# Altium schematic sheet MCU.SchDoc: Gimbal - Microcontroller
size Letter; DrawnBy: Jing Hao Yao; Organization: UW Robotics; Address1: 200 University Avenue; Address2: Waterloo; Address3: Ontario; Address4: Canada N2L 3G6; SheetNumber: 1; SheetTotal: 5
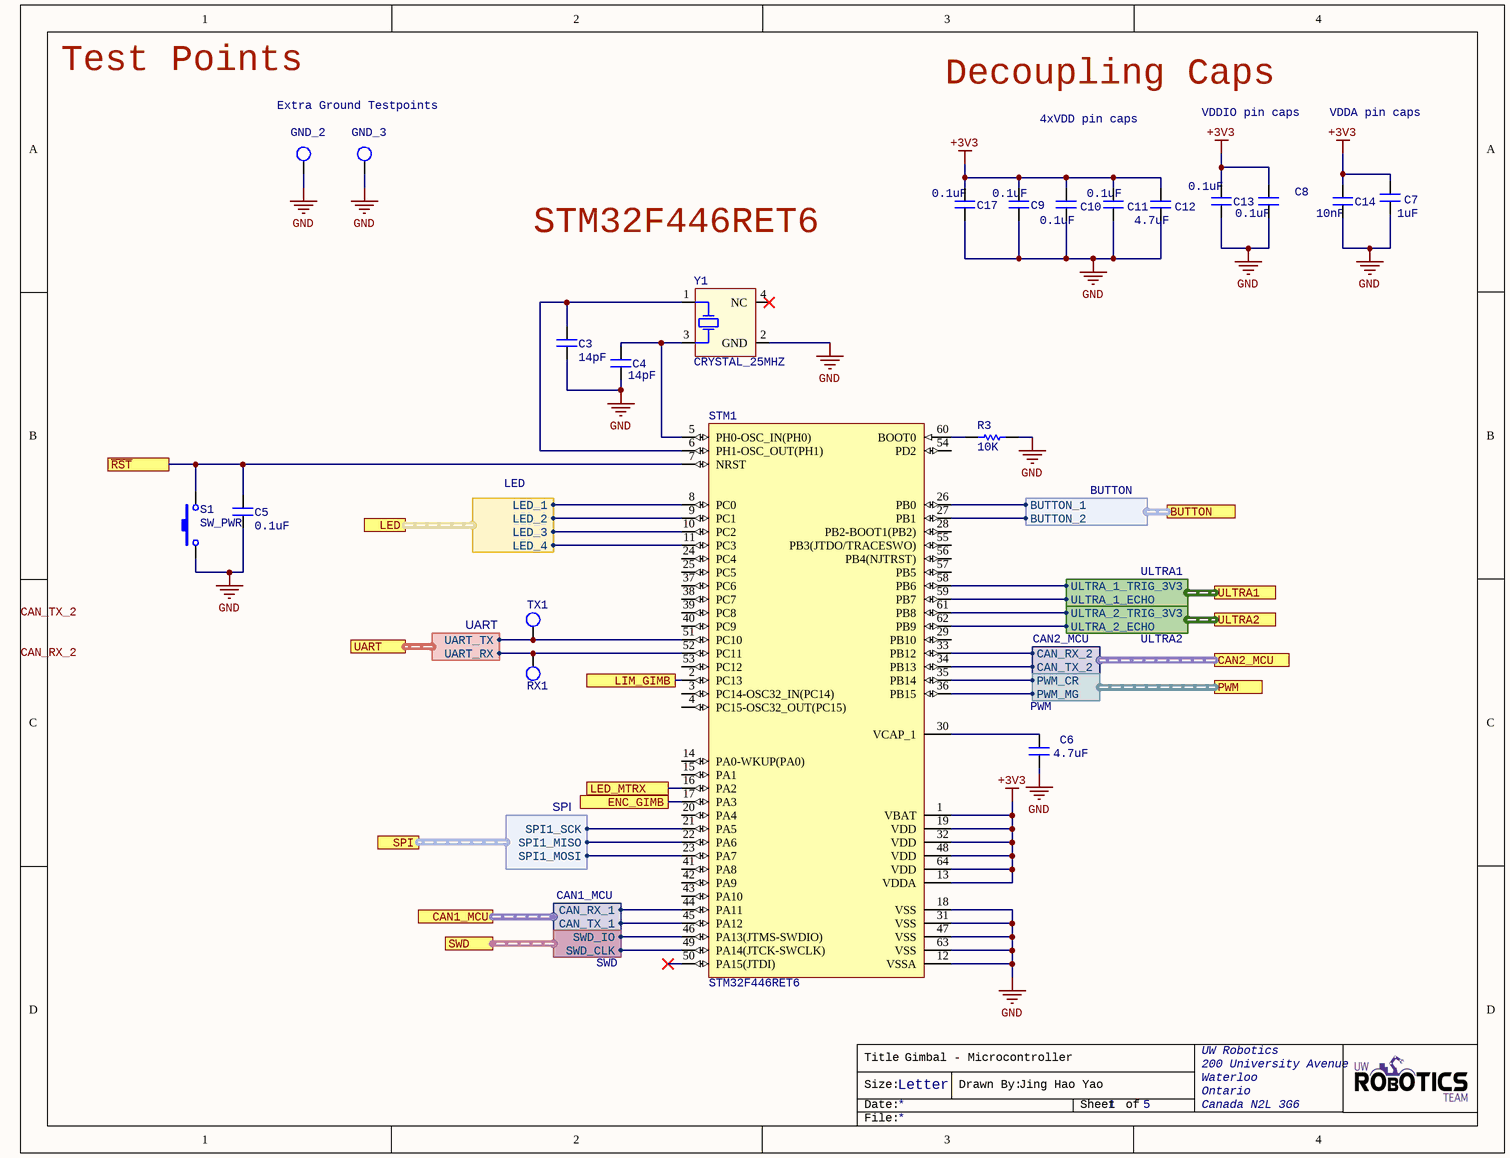
[diagram p0: MCU.SchDoc]

## Parts
C3  value 14pF  [CAPC0603(1608)55_N]  (hidden comment: CL10C140JB8NNNC)
C4  value 14pF  [CAPC0603(1608)55_N]  (hidden comment: CL10C140JB8NNNC)
C5  value 0.1uF  [CAPC0603(1608)55_N]  (hidden comment: CAP_0.1uF_16V_0603)
C6  value 4.7uF  [CAPC0603(1608)55_N]  (hidden comment: CAP_4.7uF_0603)
C7  value 1uF  [CAPC0603(1608)55_N]  (hidden comment: CAP_1uF_16V_0603)
C8  value 0.1uF  [CAPC0603(1608)55_N]  (hidden comment: CAP_0.1uF_16V_0603)
C9  value 0.1uF  [CAPC0603(1608)55_N]  (hidden comment: CAP_0.1uF_16V_0603)
C10  value 0.1uF  [CAPC0603(1608)55_N]  (hidden comment: CAP_0.1uF_16V_0603)
C11  value 0.1uF  [CAPC0603(1608)55_N]  (hidden comment: CAP_0.1uF_16V_0603)
C12  value 4.7uF  [CAPC0603(1608)55_N]  (hidden comment: CAP_4.7uF_0603)
C13  value 0.1uF  [CAPC0603(1608)55_N]  (hidden comment: CAP_0.1uF_16V_0603)
C14  value 10nF  [CAPC0603(1608)55_N]  (hidden comment: CAP_10nF_0603)
C17  value 0.1uF  [CAPC0603(1608)55_N]  (hidden comment: CAP_0.1uF_16V_0603)
GND_2  TESTPOINT_LOOP  [TESTPOINT_LOOP]  (value not drawn)
GND_3  TESTPOINT_LOOP  [TESTPOINT_LOOP]  (value not drawn)
R3  value 10K  [RESC0603(1608)_N]  (hidden comment: RES_10K_0603)
RX1  TESTPOINT_LOOP  [TESTPOINT_LOOP]  (value not drawn)
S1  SW_PWR  [PTS830GM140]
STM1  STM32F446RET6  [STM-LQFP64_L]
TX1  TESTPOINT_LOOP  [TESTPOINT_LOOP]  (value not drawn)
Y1  CRYSTAL_25MHZ  [AVX-CX2520DB32000D0GEJZ1-4_V]

## Ports
BUTTON (harness BUTTON), CAN1_MCU (harness CAN1_MCU), CAN2_MCU (harness CAN2_MCU), ENC_GIMB, LED (harness LED), LED_MTRX, LIM_GIMB, PWM (harness PWM), SPI (harness SPI), SWD (harness SWD), UART (harness UART), ULTRA1 (harness ULTRA1), ULTRA2 (harness ULTRA2), ~{RST}

## Harnesses
UART: UART_RX, UART_TX
ULTRA1: ULTRA_1_TRIG_3V3, ULTRA_1_ECHO
ULTRA2: ULTRA_2_TRIG_3V3, ULTRA_2_ECHO
CAN1_MCU: CAN_RX_1, CAN_TX_1
CAN2_MCU: CAN_RX_2, CAN_TX_2
LED: LED_1, LED_2, LED_3, LED_4
SPI: SPI1_SCK, SPI1_MISO, SPI1_MOSI
SWD: SWD_IO, SWD_CLK
BUTTON: BUTTON_1, BUTTON_2
PWM: PWM_CR, PWM_MG

## Nets
+3V3: C7.2 C8.2 C9.2 C10.2 C11.2 C12.2 C13.2 C14.2 C17.2 STM1.1(VBAT) STM1.13(VDDA) STM1.19(VDD) STM1.32(VDD) STM1.48(VDD) STM1.64(VDD)
GND: C3.1 C4.1 C5.1 C6.1 C7.1 C8.1 C9.1 C10.1 C11.1 C12.1 C13.1 C14.1 C17.1 GND_2.1 GND_3.1 R3.2 S1.1 STM1.12(VSSA) STM1.18(VSS) STM1.31(VSS) STM1.47(VSS) STM1.63(VSS) Y1.2(GND)
~{RST}: C5.2 S1.2 STM1.7(NRST) ; port ~{RST}
ENC_GIMB: STM1.17(PA3) ; port ENC_GIMB
LED_MTRX: STM1.16(PA2) ; port LED_MTRX
LIM_GIMB: STM1.2(PC13) ; port LIM_GIMB
NetC3_2: C3.2 STM1.6(PH1-OSC_OUT(PH1)) Y1.1(HOT)
NetC4_2: C4.2 STM1.5(PH0-OSC_IN(PH0)) Y1.3(HOT)
NetC6_2: C6.2 STM1.30(VCAP_1)
NetR3_1: R3.1 STM1.60(BOOT0)
NetRX1_1: RX1.1 STM1.52(PC11) ; port UART.UART_RX
NetSTM1_8: STM1.8(PC0) ; port LED.LED_1
NetSTM1_9: STM1.9(PC1) ; port LED.LED_2
NetSTM1_10: STM1.10(PC2) ; port LED.LED_3
NetSTM1_11: STM1.11(PC3) ; port LED.LED_4
NetSTM1_21: STM1.21(PA5) ; port SPI.SPI1_SCK
NetSTM1_22: STM1.22(PA6) ; port SPI.SPI1_MISO
NetSTM1_23: STM1.23(PA7) ; port SPI.SPI1_MOSI
NetSTM1_26: STM1.26(PB0) ; port BUTTON.BUTTON_1
NetSTM1_27: STM1.27(PB1) ; port BUTTON.BUTTON_2
NetSTM1_33: STM1.33(PB12) ; port CAN2_MCU.CAN_RX_2
NetSTM1_34: STM1.34(PB13) ; port CAN2_MCU.CAN_TX_2
NetSTM1_35: STM1.35(PB14) ; port PWM.PWM_CR
NetSTM1_36: STM1.36(PB15) ; port PWM.PWM_MG
NetSTM1_44: STM1.44(PA11) ; port CAN1_MCU.CAN_RX_1
NetSTM1_45: STM1.45(PA12) ; port CAN1_MCU.CAN_TX_1
NetSTM1_46: STM1.46(PA13(JTMS-SWDIO)) ; port SWD.SWD_IO
NetSTM1_49: STM1.49(PA14(JTCK-SWCLK)) ; port SWD.SWD_CLK
NetSTM1_51: STM1.51(PC10) TX1.1 ; port UART.UART_TX
NetSTM1_58: STM1.58(PB6) ; port ULTRA1.ULTRA_1_TRIG_3V3
NetSTM1_59: STM1.59(PB7) ; port ULTRA1.ULTRA_1_ECHO
NetSTM1_61: STM1.61(PB8) ; port ULTRA2.ULTRA_2_TRIG_3V3
NetSTM1_62: STM1.62(PB9) ; port ULTRA2.ULTRA_2_ECHO

Not connected (* = marked no-connect by the designer): STM1 3(PC14-OSC32_IN(PC14)) 4(PC15-OSC32_OUT(PC15)) 14(PA0-WKUP(PA0)) 15(PA1) 20(PA4) 24(PC4) 25(PC5) 28(PB2-BOOT1(PB2)) 29(PB10) 37(PC6) 38(PC7) 39(PC8) 40(PC9) 41(PA8) 42(PA9) 43(PA10) 50(PA15(JTDI))* 53(PC12) 54(PD2) 55(PB3(JTDO/TRACESWO)) 56(PB4(NJTRST)) 57(PB5); Y1 4(NC)*

## Notes on the sheet
- Test Points
- Decoupling Caps
- Extra Ground Testpoints
- 4xVDD pin caps
- VDDIO pin caps
- VDDA pin caps
- STM32F446RET6
- Labels drawn without touching a wire or pin: CAN_RX_2, CAN_TX_2
- Title
- Size:
- Date:
- Letter
- Drawn By:
- Sheet
- of
- File:

## Library data of the parts
C3 C4 = CL10C140JB8NNNC: Cap Ceramic 14pF 50V C0G 5% SMD 0603 125C Cardboard T/R; Manufacturer 1: Samsung; Voltage Rating: 50V; Supplier Part Number 1: 1276-2187-1-ND; Supplier 1: Digi-Key; Manufacturer Part Number 1: CL10C140JB8NNNC; Stock 1: 187088; Pricing 1: 1=0.10000, 10=0.06700, 100=0.02980, 500=0.02130, 1000=0.01673 (USD); RoHS: Yes; Mount: Surface Mount; Case/Package: 0603; Case Code (Metric): 1608; Case Code (Imperial): 0603; Min Operating Temperature: -55°C; Max Operating Temperature: 125°C; Tolerance: 5%; Package Quantity: 1; Packaging: Tape and Reel; Voltage Rating (DC): 50V; Dielectric: C0G; Length: 1.6mm; Height: 0.8mm; Width: 0.031inch; Depth: 0.8mm; Thickness: 0.035inch; Radiation Hardening: No; ComponentLink1URL: https://datasheet.ciiva.com/25782/cl10c140jb8nnnc-25782947.pdf?src-supplier=Digi-Key; ComponentLink1Description: https://datasheet.ciiva.com/25782/cl10c140jb8nnnc-25782947.pdf?src-supplier=Digi-Key; Capacitance: 14pF
C5 C8-C11 C13 C17 = CAP_0.1uF_16V_0603: CAP CER 0.1UF 16V X7R 0603; Manufacturer: Yageo; MPN: CC0603KRX7R7BB104; Dimensions: 0.063" L x 0.031" W (1.60mm x 0.80mm); Package: 0603 (1608 Metric); Temperature Coefficient: X7R; Voltage Rating: 16V; Supplier Part Number 1: 311-1088-1-ND; Supplier 1: Digi-Key
C6 C12 = CAP_4.7uF_0603: CAP CER 4.7UF 6.3V X5R 0603; Manufacturer: Yageo; MPN: CC0603KRX5R5BB475; Dimensions: 0.063" L x 0.031" W (1.60mm x 0.80mm); Package: 0603 (1608 Metric); Temperature Coefficient: X5R; Voltage Rating: 6.3V; Supplier Part Number 1: 311-1521-1-ND; Supplier 1: Digi-Key
C7 = CAP_1uF_16V_0603: CAP CER 1UF 16V Y5V 0603; Manufacturer: Yageo; MPN: CC0603ZRY5V7BB105; Dimensions: 0.063" L x 0.031" W (1.60mm x 0.80mm); Package: 0603 (1608 Metric); Temperature Coefficient: Y5V; Voltage Rating: 16V; Supplier Part Number 1: 311-1372-1-ND; Supplier 1: Digi-Key
C14 = CAP_10nF_0603: CAP CER 10000PF 16V X7R 0603; Manufacturer: Yageo; MPN: CC0603KRX7R7BB103; Dimensions: 0.063" L x 0.031" W (1.60mm x 0.80mm); Package: 0603 (1608 Metric); Temperature Coefficient: X7R; Voltage Rating: 16V; Supplier Part Number 1: 311-3369-1-ND; Supplier 1: Digi-Key
GND_2 GND_3 RX1 TX1 = TESTPOINT_LOOP: Loop testpoint through-hole pad; Manufacturer: Keystone Electronics; Manufacturer Part Number 1: 5002; Supplier Part Number 1: 36-5002-ND; Supplier 1: Digi-Key
R3 = RES_10K_0603: RES SMD 10K OHM 5% 1/10W 0603; Manufacturer: Yageo; MPN: RC0603JR-0710KL; Package: 0603 (1608 Metric); Dimensions: 0.063" L x 0.031" W (1.60mm x 0.80mm); Tolerance: 5%; Supplier Part Number 1: 311-10KGRCT-ND; Supplier 1: Digi-Key
S1 = SW_PWR: Power Switch (Red); pin to pad: 2>4; MPN: PTS830GM140 SMTR LFS; Manufacturer: C&K; ComponentLink1Description: Datasheet; ComponentLink1URL: https://www.ckswitches.com/media/1478/pts830.pdf; Supplier Part Number 1: CKN10587CT-ND; Supplier 1: Digi-Key
STM1 = MCU_STM32F446RET6: ARM Cortex-M4 32-bit MCU+FPU, 512 KB Flash, 128 KB Internal RAM, 50 I/Os, 64-Pin LQFP, -40 to 85 degC, Tray; I/Os (High Current): 50; Supply Voltage(Vcc) min (V): 1.7; Operating Frequency(F) (Processor speed) (MHz): 180; D/A Converter: 2; Internal RAM Size (kB): 128; FLASH Size (Prog) (kB): 512; Core: ARM Cortex-M4; ComponentLink1Description: Manufacturer URL; Package Reference: 64-Pin Low-profile Quad Flat Package, Body 10 x 10 mm, Pitch 0.5 mm; ComponentLink2URL: http://www.st.com/st-web-ui/static/active/en/resource/technical/document/datasheet/DM00141306.pdf; Packing: Tray; DatasheetVersion: Rev. 6; ComponentLink1URL: http://www.st.com/; ComponentLink2Description: Datasheet; Package Description: LQFP64; Mounting Technology: Surface Mount; Supplier Part Number 1: 497-15376-ND; Supplier 1: Digi-Key
Y1 = CRYSTAL_25MHZ: CRYSTAL 25.0000MHZ 12PF SMD; Manufacturer 1: Kyocera AVX; Manufacturer Part Number 1: CX2520DB25000H0FLJC1; Frequency: 25MHz; ESR (Equivalent Series Resistance): 80R; Frequency Stability: 15ppm; Frequency Tolerance: 10ppm; ComponentLink1Description: https://media.digikey.com/pdf/Data%20Sheets/AVX%20PDFs/CX2520DB_USY1M-H1-16429-00_Spec.pdf?src-supplier=Digi-Key; ComponentLink1URL: https://media.digikey.com/pdf/Data%20Sheets/AVX%20PDFs/CX2520DB_USY1M-H1-16429-00_Spec.pdf?src-supplier=Digi-Key; Supplier 1: Digi-Key; Supplier Part Number 1: 1253-1724-1-ND; Stock 1: 11741; Pricing 1: 1=0.72000, 10=0.63300, 50=0.59120, 100=0.52250, 500=0.49500, 1000=0.41250 (USD); RoHS: Yes; Mount: Surface Mount; Case/Package: SMD/SMT; Min Operating Temperature: -30°C; Max Operating Temperature: 85°C; Packaging: Tape and Reel; Load Capacitance: 12pF; Length: 0.098inch; Height: 0.022inch; Width: 0.079inch; Ratings: AEC-Q200